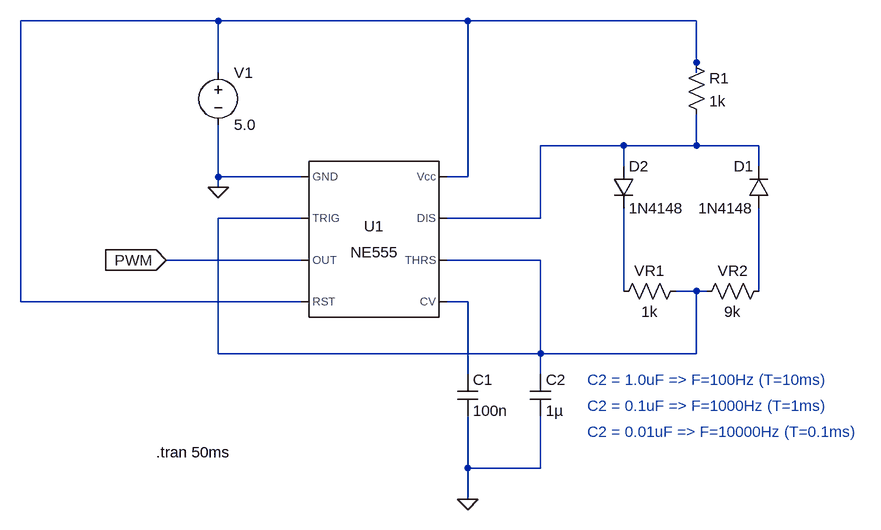
[diagram p0: schematic pwm-555.asc]
pwm-555.asc, the LTspice schematic file:
Version 4
SHEET 1 1572 1544
WIRE -64 -160 -368 -160
WIRE 320 -160 -64 -160
WIRE 672 -160 320 -160
WIRE 672 -96 672 -160
WIRE -64 -80 -64 -160
WIRE 672 -80 672 -96
WIRE 560 32 432 32
WIRE 672 32 672 -16
WIRE 672 32 560 32
WIRE 768 32 672 32
WIRE 560 64 560 32
WIRE 768 64 768 32
WIRE -64 80 -64 0
WIRE 64 80 -64 80
WIRE 320 80 320 -160
WIRE 320 80 288 80
WIRE -64 96 -64 80
WIRE 64 144 -64 144
WIRE 432 144 432 32
WIRE 432 144 288 144
WIRE 64 208 -144 208
WIRE 432 208 288 208
WIRE 560 256 560 128
WIRE 672 256 640 256
WIRE 688 256 672 256
WIRE 768 256 768 128
WIRE -368 272 -368 -160
WIRE 64 272 -368 272
WIRE 320 272 288 272
WIRE -64 352 -64 144
WIRE 432 352 432 208
WIRE 432 352 -64 352
WIRE 672 352 672 256
WIRE 672 352 432 352
WIRE 320 384 320 272
WIRE 432 384 432 352
WIRE 320 528 320 448
WIRE 432 528 432 448
WIRE 432 528 320 528
WIRE 320 576 320 528
FLAG 320 576 0
FLAG -64 96 0
FLAG -144 208 PWM
IOPIN -144 208 In
SYMBOL Misc\\NE555 176 176 R0
SYMATTR InstName U1
SYMBOL cap 304 384 R0
SYMATTR InstName C1
SYMATTR Value 100n
SYMBOL voltage -64 -96 R0
WINDOW 123 0 0 Left 2
WINDOW 39 0 0 Left 2
SYMATTR InstName V1
SYMATTR Value 5.0
SYMBOL diode 784 128 R180
WINDOW 0 24 64 Left 2
WINDOW 3 24 0 Left 2
SYMATTR InstName D1
SYMATTR Value 1N4148
SYMBOL cap 416 384 R0
SYMATTR InstName C2
SYMATTR Value 1µ
SYMBOL res 656 -112 R0
SYMATTR InstName R1
SYMATTR Value 1k
SYMBOL diode 544 64 R0
SYMATTR InstName D2
SYMATTR Value 1N4148
SYMBOL res 656 240 R90
WINDOW 0 0 56 VBottom 2
WINDOW 3 32 56 VTop 2
SYMATTR InstName VR1
SYMATTR Value 1k
SYMBOL res 784 240 R90
WINDOW 0 0 56 VBottom 2
WINDOW 3 32 56 VTop 2
SYMATTR InstName VR2
SYMATTR Value 9k
TEXT -160 504 Left 2 !.tran 50ms
TEXT 504 392 Left 2 ;C2 = 1.0uF => F=100Hz (T=10ms)
TEXT 504 432 Left 2 ;C2 = 0.1uF => F=1000Hz (T=1ms)
TEXT 504 472 Left 2 ;C2 = 0.01uF => F=10000Hz (T=0.1ms)

The netlist it stands for:
* pwm-555.asc
XU1 0 N003 PWM N001 N006 N003 N002 N001 NE555  ; pins GND TRIG OUT RST CV THRS DIS Vcc
C1 N006 0 100n
V1 N001 0 5.0
D1 N005 N002 1N4148
C2 N003 0 1µ
R1 N001 N002 1k
D2 N002 N004 1N4148
R§VR1 N003 N004 1k
R§VR2 N005 N003 9k
.model D D
.lib standard.dio
.tran 50ms
* C2 = 1.0uF => F=100Hz (T=10ms)
* C2 = 0.1uF => F=1000Hz (T=1ms)
* C2 = 0.01uF => F=10000Hz (T=0.1ms)
.lib NE555.sub
.backanno
.end